# EAGLE design canbus-nic (EAGLE 7.7.0)
CAN Bus NIC Assembly Operation "Valhalla" CLASSIFIED: SECRET, NEED-TO-KNOW-ONLY This is the CAN Bus NIC module containing the CAN controller and transceiver chips. The transceiver is bus powered while the rest of the electronics are powered by the CPU module they plug into. The controller interfaces with the CPU via SPI.
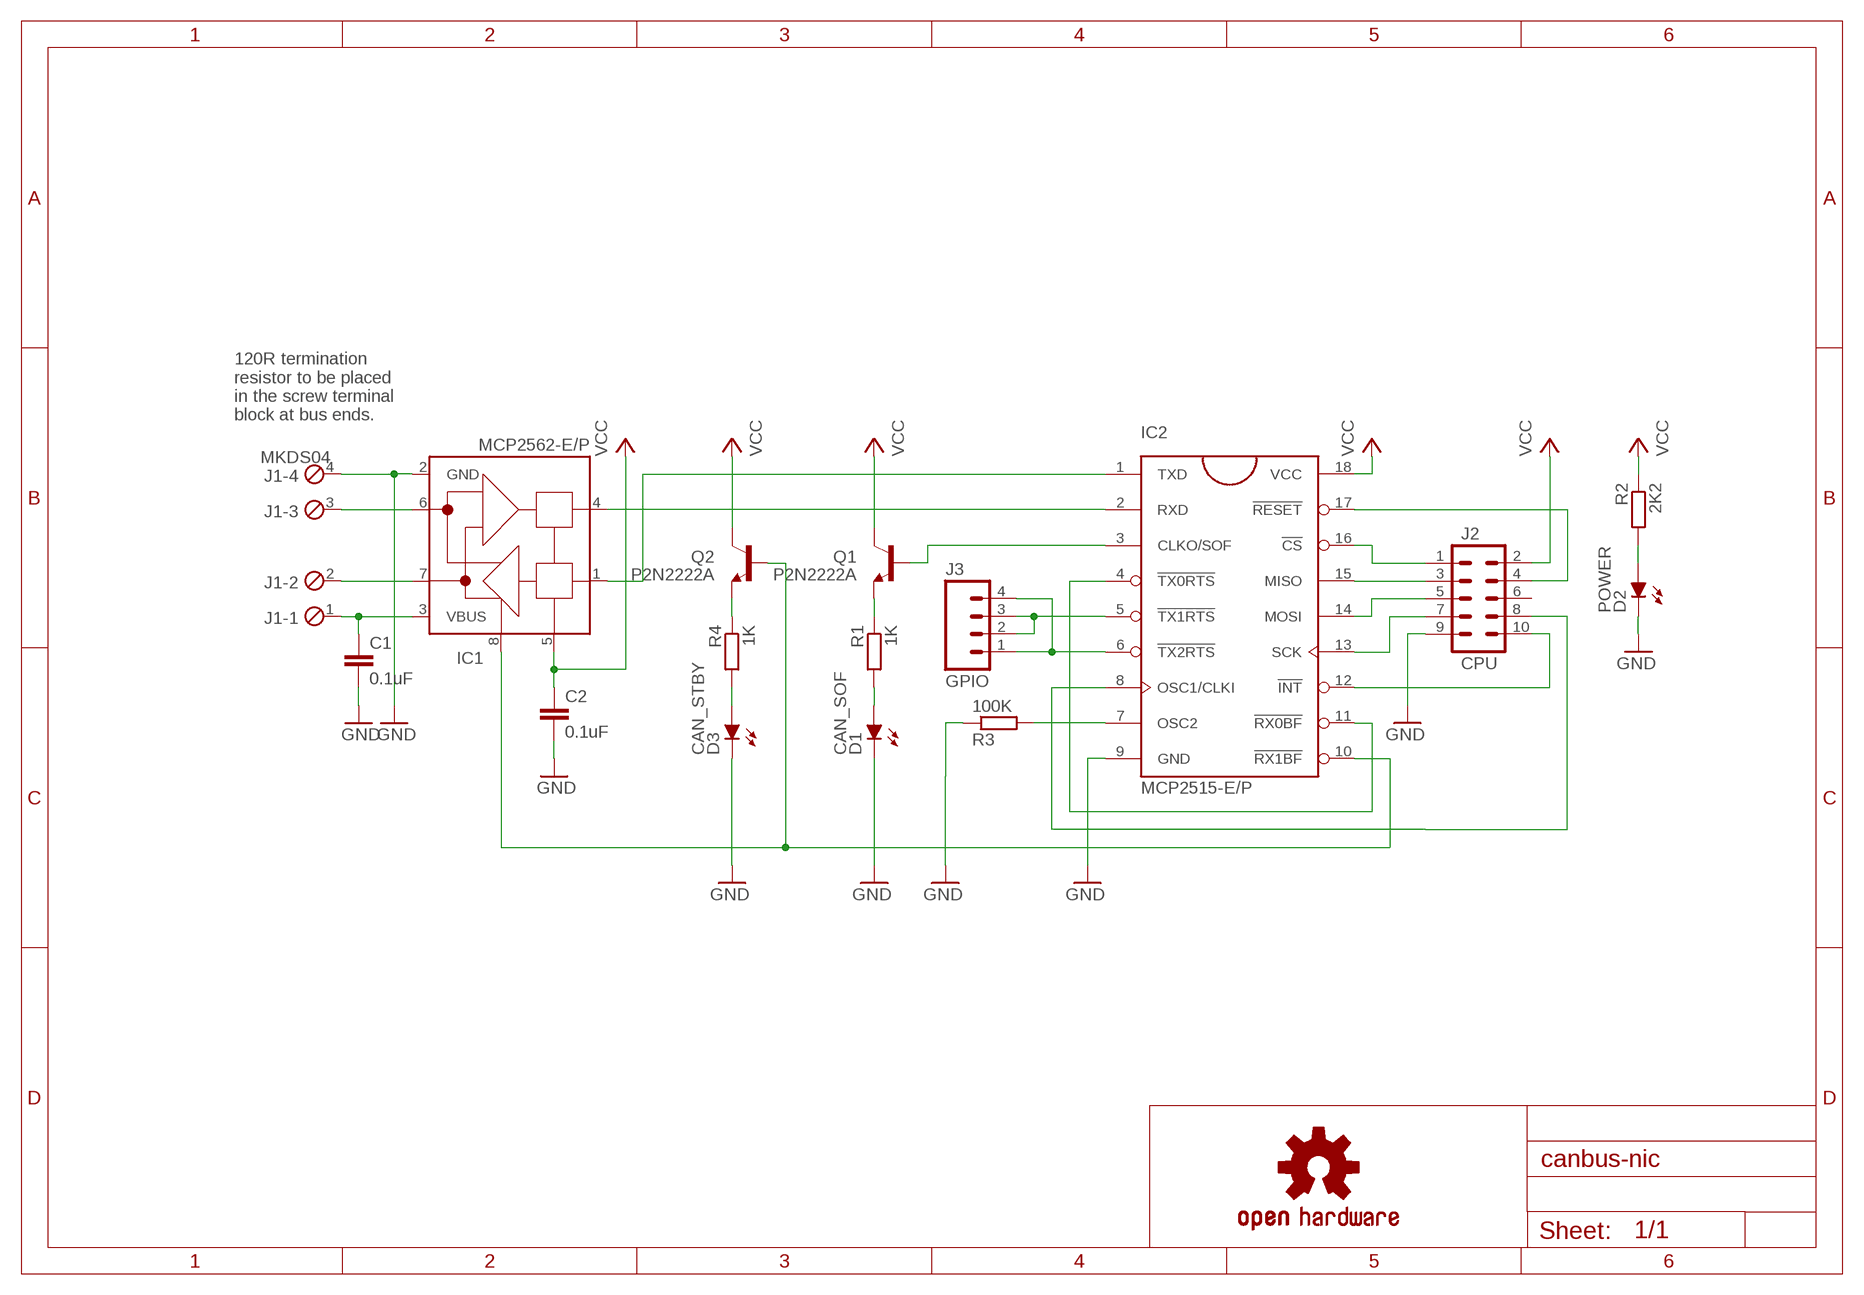
[diagram p0: schematic, sheet 1]

## Parts
C1  0.1uF  C-EU050-025X075  [C050-025X075]
C2  0.1uF  C-EU050-025X075  [C050-025X075]
D1  CAN_SOF  LED3MM  [LED3MM]
D2  POWER  LED3MM  [LED3MM]
D3  CAN_STBY  LED3MM  [LED3MM]
IC1  MCP2562-E/P  [DIL08]
IC2  MCP2515-E/P  [DIL18]
J1  MKDS04  [MKDS04]
J2  CPU  M05X2SHD  [2X5-SHROUDED]
J3  GPIO  M04PTH  [1X04]
LOGO1  OSHW-LOGOMINI  [OSHW-LOGO-MINI]
Q1  P2N2222A  [TO92]
Q2  P2N2222A  [TO92]
R1  1K  R-EU_0207/5V  [0207/5V]
R2  2K2  R-EU_0207/5V  [0207/5V]
R3  100K  R-EU_0207/5V  [0207/5V]
R4  1K  R-EU_0207/5V  [0207/5V]

## Nets
!GPI0: IC2.5(!TX1RTS) J3.2 J3.3
!GPI1: IC2.6(!TX2RTS) J3.1 J3.4
GND: C1.2 C2.2 D1.K(C) D2.K(C) D3.K(C) IC1.2(GND) IC2.9(GND) J1.4 J2.9 R3.1
N$1: IC1.1(TXD) IC2.1(TXD)
N$2: IC1.4(RXD) IC2.2(RXD)
N$3: IC1.6(CANL) J1.3
N$4: IC1.7(CANH) J1.2
N$5: D2.A R2.2
N$6: IC1.8(STBY) IC2.10(!RX1BF) Q2.2(B)
N$7: IC2.15(MISO) J2.3
N$8: IC2.7(OSC2) R3.2
N$9: IC2.13(SCK) J2.7
N$10: IC2.16(!CS) J2.1
N$11: D3.A R4.2
N$12: IC2.12(!INT) J2.10
N$13: IC2.17(!RESET) J2.4
N$14: Q2.1(E) R4.1
N$19: IC2.8(OSC1/CLKI) J2.8
N$20: Q1.1(E) R1.1
N$21: D1.A R1.2
N$22: IC2.4(!TX0RTS) IC2.11(!RX0BF)
N$23: IC2.3(CLKO/SOF) Q1.2(B)
N$24: C1.1 IC1.3(VBUS) J1.1
N$27: IC2.14(MOSI) J2.5
VCC: C2.1 IC1.5(VCC) IC2.18(VCC) J2.2 Q1.3(C) Q2.3(C) R2.1
Unconnected: J2.6

## Notes on the sheet
- 120R termination
  resistor to be placed
  in the screw terminal
  block at bus ends.

## Library data of the parts
C1 C2 = rcl:C-EU: CAPACITOR, European symbol
D1-D3 = led:LED: LED Various Types
IC1 = radu-collected:MCP2562-*/: Microchip MCP2562 CAN Transceiver
IC2 = radu-collected:MCP2515-*/: Microchip MCP2515 CANBus Controller with SPI Interface
J1 = con-phoenix-508:MKDS04: Screw Connector
J2 = SparkFun-Connectors-mine:M05X2: Header 5x2 Standard 10-pin dual row 0.1" header. Commonly used with AVR-ISP. Use with Spark Fun Electronics SKU: PRT-00778
J3 = SparkFun-Connectors-mine:M04: Header 4 Standard 4-pin 0.1" header. Use with straight break away headers (SKU : PRT-00116), right angle break away headers (PRT-00553), swiss pins (PRT-00743), machine pins (PRT-00117), and female headers (PRT-00115). Molex polarized connector foot print use with SKU : PRT-08231 with associated crimp pins and housings. 1MM SMD Version SKU: PRT-10208; PROD_ID: CONN-09696
LOGO1 = SparkFun-Aesthetics:OSHW-LOGO: Open Source Hardware Logo This logo indicates the piece of hardware it is found on incorporates a OSHW license and/or adheres to the definition of open source hardware found here: http://freedomdefined.org/OSHW
Q1 Q2 = transistor-npn:P2N2222A: NPN Transistor
R1-R4 = rcl:R-EU_: RESISTOR, European symbol

## Board
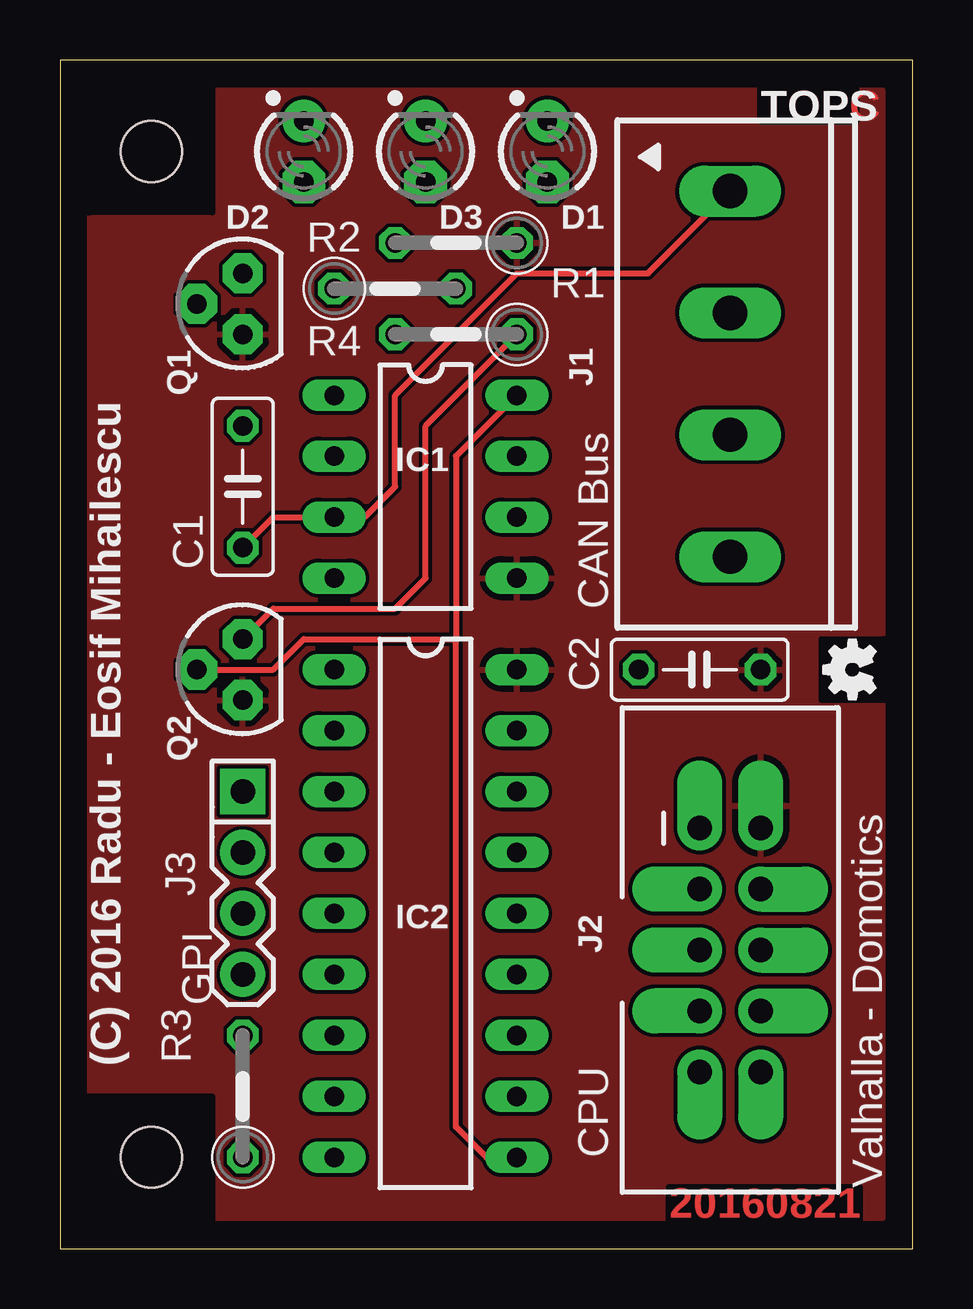
[diagram p1: board, top side]
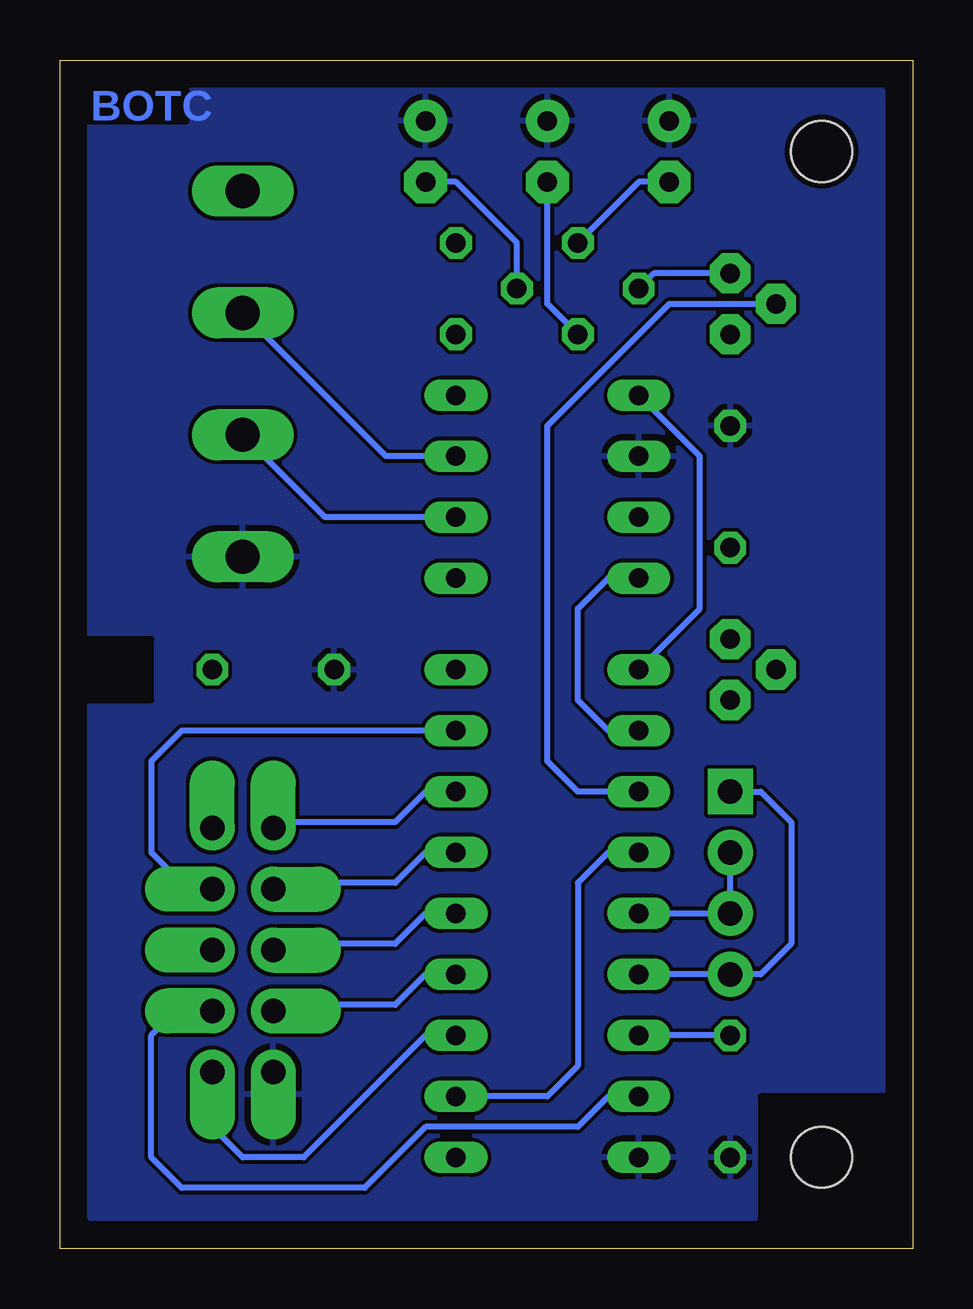
[diagram p2: board, bottom side, seen from below]

Size 35.56 x 49.53 mm. Coordinates in mm from the lower left corner, seen from the top.
Outline: 0,0 35.56,0 35.56,49.53 0,49.53 0,0
Copper layers (1*16): Top 0.035mm / dielectric 1.5mm / Bottom 0.035mm
Design rules "SeeedStudio_2layer_DRU_no_angle_20140221 *": minimum track width 6mil, minimum drill 12mil, track to track 6mil, track to pad 6mil, pad to pad 6mil, via to via 6mil, smd to smd 0mil, copper to edge 10mil, drill to drill 10mil, minimum pad ring 10mil, minimum via ring 6mil, stop-mask expansion 2mil, vias tented up to drill 100mil, thermal gap 10mil
Holes 2.54 mm at 3.81,45.72 3.81,3.81

### Footprints (pad centres in the part's own frame; a part is rotated, then mirrored left to right if it is on the bottom)
C050-025X075 = drill 0.813 octagon: 1 -2.54,0; 2 2.54,0
LED3MM = drill 0.813 pad 1.778 octagon: A -1.27,0 | drill 0.813 pad 1.778: K 1.27,0
DIL08 = drill 0.813 long: 1 -3.81,-3.81; 2 -1.27,-3.81; 3 1.27,-3.81; 4 3.81,-3.81; 5 3.81,3.81; 6 1.27,3.81; 7 -1.27,3.81; 8 -3.81,3.81
DIL18 = drill 0.813 long: 1 -10.16,-3.81; 2 -7.62,-3.81; 3 -5.08,-3.81; 4 -2.54,-3.81; 5 0,-3.81; 6 2.54,-3.81; 7 5.08,-3.81; 8 7.62,-3.81; 9 10.16,-3.81; 10 10.16,3.81; 11 7.62,3.81; 12 5.08,3.81; 13 2.54,3.81; 14 0,3.81; 15 -2.54,3.81; 16 -5.08,3.81; 17 -7.62,3.81; 18 -10.16,3.81
MKDS04 = drill 1.422 long: 1 -7.62,0; 2 -2.54,0; 3 2.54,0; 4 7.62,0
2X5-SHROUDED = drill 1.016 pad 1.88 offset: 1 -1.27,5.08; 2 1.27,5.08; 3 -1.27,2.54; 4 1.27,2.54; 5 -1.27,0; 6 1.27,0; 7 -1.27,-2.54; 8 1.27,-2.54; 9 -1.27,-5.08; 10 1.27,-5.08
1X04 = drill 1.016 pad 1.88 square: 1 0,0 | drill 1.016 pad 1.88: 2 2.54,0; 3 5.08,0; 4 7.62,0
TO92 = drill 0.813 pad 1.676 octagon: 1 1.27,0; 2 0,1.905; 3 -1.27,0
0207/5V = drill 0.813 octagon: 1 -2.54,0; 2 2.54,0

### Placement (x,y rotation side)
C1  7.62,31.75 90 top
C2  26.67,24.13 180 top
D1  20.32,45.72 90 top
D2  10.16,45.72 90 top
D3  15.24,45.72 90 top
IC1  15.24,31.75 270 top
IC2  15.24,13.97 270 top
J1  27.94,36.45 270 top
J2  27.94,12.45 0 top
J3  7.62,19.05 270 top
LOGO1  33.02,24.13 90 top
Q1  7.62,39.37 90 top
Q2  7.62,24.13 90 top
R1  13.97,40.01 0 top
R2  16.51,41.91 180 top
R3  7.62,6.35 90 top
R4  16.51,38.1 180 top

### Tracks (layer width: path | path; a pad name or v marks a point on that pad's centre or on a via)
!GPI0
  Bottom 0.254: IC2.5 J3.3 J3.2
!GPI1
  Bottom 0.254: IC2.6 J3.4 6.35,11.43 5.08,12.7 5.08,17.78 6.35,19.05 J3.1
GND
  pour Bottom: 1.27,48.26 1.27,1.27 34.29,1.27 34.29,48.26
N$1
  Bottom 0.254: IC2.1 8.89,26.67 8.89,33.02 IC1.1
N$2
  Bottom 0.254: IC2.2 12.7,21.59 13.97,22.86 13.97,26.67 12.7,27.94 IC1.4
N$3
  Bottom 0.254: IC1.6 24.51,30.48 J1.3
N$4
  Bottom 0.254: IC1.7 21.97,33.02 J1.2
N$5
  Bottom 0.254: D2.A 11.43,44.45 R2.2
N$6
  Top 0.254: Q2.2 8.89,24.13 10.16,25.4 16.51,25.4 | IC1.8 16.51,33.02 16.51,25.4 | IC2.10 17.78,3.81 16.51,5.08 16.51,25.4
N$7
  Bottom 0.254: IC2.15 20.32,16.51 21.59,15.24 26.42,15.24 J2.3
N$8
  Bottom 0.254: R3.2 IC2.7
N$9
  Bottom 0.254: IC2.13 20.32,11.43 21.59,10.16 26.42,10.16 J2.7
N$10
  Bottom 0.254: IC2.16 20.32,19.05 21.59,17.78 26.42,17.78 J2.1
N$11
  Bottom 0.254: R4.2 15.24,39.37 D3.A
N$12
  Bottom 0.254: IC2.12 20.32,8.89 21.59,7.62 25.4,3.81 27.94,3.81 29.21,5.08 J2.10
N$13
  Bottom 0.254: IC2.17 30.48,21.59 31.75,20.32 31.75,16.51 30.48,15.24 29.46,15.24 J2.4
N$14
  Top 0.254: Q2.1 8.89,26.67 13.97,26.67 15.24,27.94 15.24,34.29 R4.1
N$16
  cutout Top: 1.27,48.26 6.35,48.26 6.35,43.18 1.27,43.18
N$17
  cutout Bottom: 1.27,6.35 6.35,6.35 6.35,1.27 1.27,1.27
N$18
  cutout Top: 1.27,6.35 6.35,6.35 6.35,1.27 1.27,1.27
N$19
  Bottom 0.254: IC2.8 12.7,6.35 13.97,5.08 20.32,5.08 22.86,2.54 30.48,2.54 31.75,3.81 31.75,8.89 30.48,10.16 29.46,10.16 J2.8
N$20
  Bottom 0.254: Q1.1 10.79,40.64 R1.1
N$21
  Bottom 0.254: R1.2 16.51,41.91 19.05,44.45 D1.A
N$22
  Bottom 0.254: IC2.4 12.7,16.51 13.97,15.24 13.97,7.62 15.24,6.35 IC2.11
N$23
  Bottom 0.254: IC2.3 13.97,19.05 15.24,20.32 15.24,27.94 15.24,34.29 12.7,36.83 10.16,39.37 Q1.2
N$24
  Top 0.254: 27.05,43.18 J1.1 27.5,43.62 27.05,43.18 | C1.1 8.89,30.48 IC1.3 12.7,30.48 13.97,31.75 13.97,35.56 19.05,40.64 24.51,40.64 27.05,43.18
N$25
  cutout Bottom: 31.75,25.4 34.29,25.4 34.29,22.86 31.75,22.86
N$26
  cutout Top: 31.75,25.4 34.29,25.4 34.29,22.86 31.75,22.86
N$27
  Bottom 0.254: IC2.14 20.32,13.97 21.59,12.7 26.42,12.7 J2.5
VCC
  pour Top: 1.27,48.26 34.29,48.26 34.29,1.27 1.27,1.27

### Text on the board
Top: TOPC | 20160821
Bottom: BOTC
tPlace: TOPS | CAN Bus | GPI | (C) 2016 Radu - Eosif Mihailescu | CPU | Valhalla - Domotics